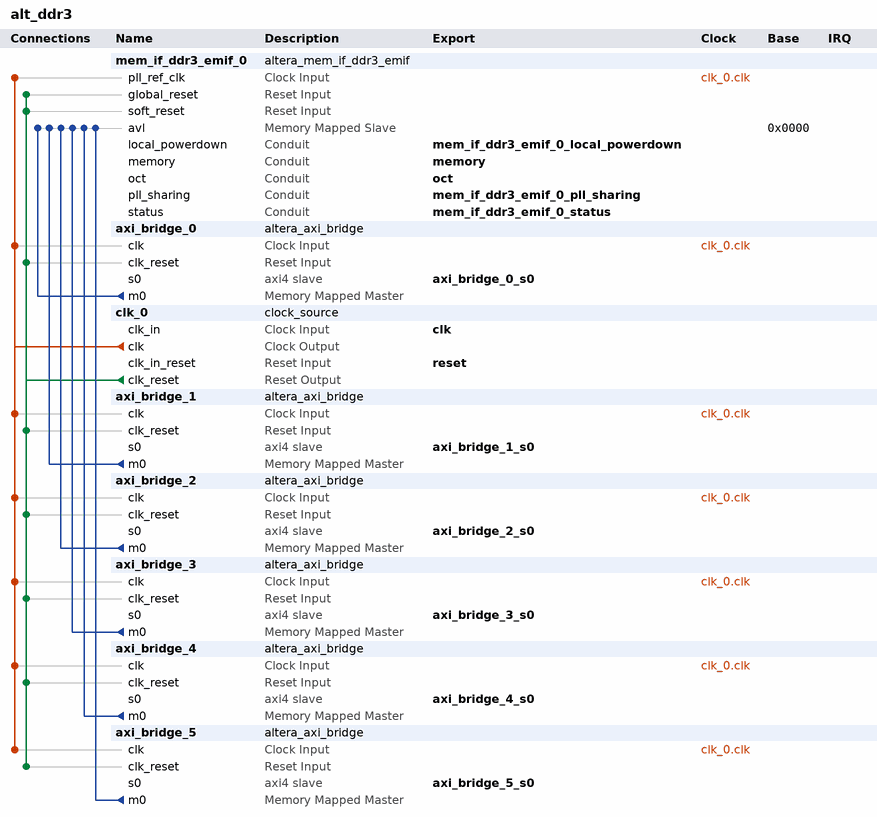
[diagram p0: system contents]
# Platform Designer (Qsys) system alt_ddr3, Cyclone V 5CGTFD9E5F35C7
# Parameters at their usual value, and those the tool derives, are not listed.
package require -exact qsys 20.1
create_system alt_ddr3
set_project_property DEVICE_FAMILY {Cyclone V}
set_project_property DEVICE 5CGTFD9E5F35C7

add_instance mem_if_ddr3_emif_0 altera_mem_if_ddr3_emif 20.1
set_instance_parameter_value mem_if_ddr3_emif_0 AVL_MAX_SIZE 8
set_instance_parameter_value mem_if_ddr3_emif_0 CALIBRATION_MODE Skip
set_instance_parameter_value mem_if_ddr3_emif_0 CFG_REORDER_DATA false
set_instance_parameter_value mem_if_ddr3_emif_0 CPORT_TYPE_PORT Bidirectional,Bidirectional,Bidirectional,Bidirectional,Bidirectional,Bidirectional
set_instance_parameter_value mem_if_ddr3_emif_0 EXPORT_AFI_HALF_CLK false
set_instance_parameter_value mem_if_ddr3_emif_0 HARD_EMIF false
set_instance_parameter_value mem_if_ddr3_emif_0 MEM_BANKADDR_WIDTH 3
set_instance_parameter_value mem_if_ddr3_emif_0 MEM_CLK_FREQ 300.0
set_instance_parameter_value mem_if_ddr3_emif_0 MEM_CLK_FREQ_MAX 800.0
set_instance_parameter_value mem_if_ddr3_emif_0 MEM_COL_ADDR_WIDTH 10
set_instance_parameter_value mem_if_ddr3_emif_0 MEM_DQ_WIDTH 16
set_instance_parameter_value mem_if_ddr3_emif_0 MEM_DRV_STR RZQ/6
set_instance_parameter_value mem_if_ddr3_emif_0 MEM_FORMAT DISCRETE
set_instance_parameter_value mem_if_ddr3_emif_0 MEM_ROW_ADDR_WIDTH 14
set_instance_parameter_value mem_if_ddr3_emif_0 MEM_RTT_NOM {ODT Disabled}
set_instance_parameter_value mem_if_ddr3_emif_0 MEM_RTT_WR {Dynamic ODT off}
set_instance_parameter_value mem_if_ddr3_emif_0 MEM_TCL 7
set_instance_parameter_value mem_if_ddr3_emif_0 MEM_TFAW_NS 50.0
set_instance_parameter_value mem_if_ddr3_emif_0 MEM_TRAS_NS 37.5
set_instance_parameter_value mem_if_ddr3_emif_0 MEM_TRCD_NS 13.125
set_instance_parameter_value mem_if_ddr3_emif_0 MEM_TRFC_NS 260.0
set_instance_parameter_value mem_if_ddr3_emif_0 MEM_TRP_NS 13.125
set_instance_parameter_value mem_if_ddr3_emif_0 MEM_TRRD_NS 7.5
set_instance_parameter_value mem_if_ddr3_emif_0 MEM_TRTP_NS 7.5
set_instance_parameter_value mem_if_ddr3_emif_0 MEM_TWTR 6
set_instance_parameter_value mem_if_ddr3_emif_0 MEM_VENDOR Micron
set_instance_parameter_value mem_if_ddr3_emif_0 MEM_WTCL 6
set_instance_parameter_value mem_if_ddr3_emif_0 PLL_LOCATION Top_Bottom
set_instance_parameter_value mem_if_ddr3_emif_0 POWER_OF_TWO_BUS false
set_instance_parameter_value mem_if_ddr3_emif_0 PRIORITY_PORT 1,1,1,1,1,1
set_instance_parameter_value mem_if_ddr3_emif_0 RATE Half
set_instance_parameter_value mem_if_ddr3_emif_0 REF_CLK_FREQ 50.0
set_instance_parameter_value mem_if_ddr3_emif_0 SPEED_GRADE 7
set_instance_parameter_value mem_if_ddr3_emif_0 TIMING_BOARD_AC_SKEW 0.04
set_instance_parameter_value mem_if_ddr3_emif_0 TIMING_BOARD_AC_TO_CK_SKEW 0.04
set_instance_parameter_value mem_if_ddr3_emif_0 TIMING_BOARD_DQ_TO_DQS_SKEW 0.004
set_instance_parameter_value mem_if_ddr3_emif_0 TIMING_BOARD_MAX_CK_DELAY 0.71
set_instance_parameter_value mem_if_ddr3_emif_0 TIMING_BOARD_MAX_DQS_DELAY 0.67
set_instance_parameter_value mem_if_ddr3_emif_0 TIMING_BOARD_SKEW_BETWEEN_DQS 0.0
set_instance_parameter_value mem_if_ddr3_emif_0 TIMING_BOARD_SKEW_CKDQS_DIMM_MAX 0.04
set_instance_parameter_value mem_if_ddr3_emif_0 TIMING_BOARD_SKEW_CKDQS_DIMM_MIN 0.0
set_instance_parameter_value mem_if_ddr3_emif_0 TIMING_BOARD_SKEW_WITHIN_DQS 0.2
set_instance_parameter_value mem_if_ddr3_emif_0 TIMING_TDH 100
set_instance_parameter_value mem_if_ddr3_emif_0 TIMING_TDQSCK 300
set_instance_parameter_value mem_if_ddr3_emif_0 TIMING_TDQSQ 150
set_instance_parameter_value mem_if_ddr3_emif_0 TIMING_TDQSS 0.25
set_instance_parameter_value mem_if_ddr3_emif_0 TIMING_TDS 25
set_instance_parameter_value mem_if_ddr3_emif_0 TIMING_TDSH 0.2
set_instance_parameter_value mem_if_ddr3_emif_0 TIMING_TDSS 0.2
set_instance_parameter_value mem_if_ddr3_emif_0 TIMING_TIH 200
set_instance_parameter_value mem_if_ddr3_emif_0 TIMING_TIS 125
set_instance_parameter_value mem_if_ddr3_emif_0 TIMING_TQSH 0.55
set_instance_parameter_value mem_if_ddr3_emif_0 USER_DEBUG_LEVEL 1

add_instance axi_bridge_0 altera_axi_bridge 20.1
set_instance_parameter_value axi_bridge_0 ADDR_WIDTH 28
set_instance_parameter_value axi_bridge_0 AXI_VERSION AXI4
set_instance_parameter_value axi_bridge_0 COMBINED_ACCEPTANCE_CAPABILITY 16
set_instance_parameter_value axi_bridge_0 COMBINED_ISSUING_CAPABILITY 16
set_instance_parameter_value axi_bridge_0 DATA_WIDTH 32
set_instance_parameter_value axi_bridge_0 M0_ID_WIDTH 1
set_instance_parameter_value axi_bridge_0 READ_ACCEPTANCE_CAPABILITY 16
set_instance_parameter_value axi_bridge_0 READ_ADDR_USER_WIDTH 64
set_instance_parameter_value axi_bridge_0 READ_DATA_REORDERING_DEPTH 1
set_instance_parameter_value axi_bridge_0 READ_DATA_USER_WIDTH 64
set_instance_parameter_value axi_bridge_0 READ_ISSUING_CAPABILITY 16
set_instance_parameter_value axi_bridge_0 S0_ID_WIDTH 1
set_instance_parameter_value axi_bridge_0 USE_M0_ARBURST 1
set_instance_parameter_value axi_bridge_0 USE_M0_ARCACHE 1
set_instance_parameter_value axi_bridge_0 USE_M0_ARID 1
set_instance_parameter_value axi_bridge_0 USE_M0_ARLEN 1
set_instance_parameter_value axi_bridge_0 USE_M0_ARLOCK 1
set_instance_parameter_value axi_bridge_0 USE_M0_ARQOS 0
set_instance_parameter_value axi_bridge_0 USE_M0_ARREGION 0
set_instance_parameter_value axi_bridge_0 USE_M0_ARSIZE 1
set_instance_parameter_value axi_bridge_0 USE_M0_ARUSER 0
set_instance_parameter_value axi_bridge_0 USE_M0_AWBURST 1
set_instance_parameter_value axi_bridge_0 USE_M0_AWCACHE 1
set_instance_parameter_value axi_bridge_0 USE_M0_AWID 1
set_instance_parameter_value axi_bridge_0 USE_M0_AWLEN 1
set_instance_parameter_value axi_bridge_0 USE_M0_AWLOCK 1
set_instance_parameter_value axi_bridge_0 USE_M0_AWQOS 0
set_instance_parameter_value axi_bridge_0 USE_M0_AWREGION 0
set_instance_parameter_value axi_bridge_0 USE_M0_AWSIZE 1
set_instance_parameter_value axi_bridge_0 USE_M0_AWUSER 0
set_instance_parameter_value axi_bridge_0 USE_M0_BID 1
set_instance_parameter_value axi_bridge_0 USE_M0_BRESP 1
set_instance_parameter_value axi_bridge_0 USE_M0_BUSER 0
set_instance_parameter_value axi_bridge_0 USE_M0_RID 1
set_instance_parameter_value axi_bridge_0 USE_M0_RLAST 1
set_instance_parameter_value axi_bridge_0 USE_M0_RRESP 1
set_instance_parameter_value axi_bridge_0 USE_M0_RUSER 0
set_instance_parameter_value axi_bridge_0 USE_M0_WSTRB 1
set_instance_parameter_value axi_bridge_0 USE_M0_WUSER 0
set_instance_parameter_value axi_bridge_0 USE_PIPELINE 1
set_instance_parameter_value axi_bridge_0 USE_S0_ARCACHE 1
set_instance_parameter_value axi_bridge_0 USE_S0_ARLOCK 1
set_instance_parameter_value axi_bridge_0 USE_S0_ARPROT 1
set_instance_parameter_value axi_bridge_0 USE_S0_ARQOS 0
set_instance_parameter_value axi_bridge_0 USE_S0_ARREGION 0
set_instance_parameter_value axi_bridge_0 USE_S0_ARUSER 0
set_instance_parameter_value axi_bridge_0 USE_S0_AWCACHE 1
set_instance_parameter_value axi_bridge_0 USE_S0_AWLOCK 1
set_instance_parameter_value axi_bridge_0 USE_S0_AWPROT 1
set_instance_parameter_value axi_bridge_0 USE_S0_AWQOS 0
set_instance_parameter_value axi_bridge_0 USE_S0_AWREGION 0
set_instance_parameter_value axi_bridge_0 USE_S0_AWUSER 0
set_instance_parameter_value axi_bridge_0 USE_S0_BRESP 1
set_instance_parameter_value axi_bridge_0 USE_S0_BUSER 0
set_instance_parameter_value axi_bridge_0 USE_S0_RRESP 1
set_instance_parameter_value axi_bridge_0 USE_S0_RUSER 0
set_instance_parameter_value axi_bridge_0 USE_S0_WLAST 1
set_instance_parameter_value axi_bridge_0 USE_S0_WUSER 0
set_instance_parameter_value axi_bridge_0 WRITE_ACCEPTANCE_CAPABILITY 16
set_instance_parameter_value axi_bridge_0 WRITE_ADDR_USER_WIDTH 64
set_instance_parameter_value axi_bridge_0 WRITE_DATA_USER_WIDTH 64
set_instance_parameter_value axi_bridge_0 WRITE_ISSUING_CAPABILITY 16
set_instance_parameter_value axi_bridge_0 WRITE_RESP_USER_WIDTH 64

add_instance clk_0 clock_source 20.1
set_instance_parameter_value clk_0 clockFrequency 50000000

add_instance axi_bridge_1 altera_axi_bridge 20.1
set_instance_parameter_value axi_bridge_1 ADDR_WIDTH 28
set_instance_parameter_value axi_bridge_1 AXI_VERSION AXI4
set_instance_parameter_value axi_bridge_1 COMBINED_ACCEPTANCE_CAPABILITY 16
set_instance_parameter_value axi_bridge_1 COMBINED_ISSUING_CAPABILITY 16
set_instance_parameter_value axi_bridge_1 DATA_WIDTH 32
set_instance_parameter_value axi_bridge_1 M0_ID_WIDTH 1
set_instance_parameter_value axi_bridge_1 READ_ACCEPTANCE_CAPABILITY 16
set_instance_parameter_value axi_bridge_1 READ_ADDR_USER_WIDTH 64
set_instance_parameter_value axi_bridge_1 READ_DATA_REORDERING_DEPTH 1
set_instance_parameter_value axi_bridge_1 READ_DATA_USER_WIDTH 64
set_instance_parameter_value axi_bridge_1 READ_ISSUING_CAPABILITY 16
set_instance_parameter_value axi_bridge_1 S0_ID_WIDTH 1
set_instance_parameter_value axi_bridge_1 USE_M0_ARBURST 1
set_instance_parameter_value axi_bridge_1 USE_M0_ARCACHE 1
set_instance_parameter_value axi_bridge_1 USE_M0_ARID 1
set_instance_parameter_value axi_bridge_1 USE_M0_ARLEN 1
set_instance_parameter_value axi_bridge_1 USE_M0_ARLOCK 1
set_instance_parameter_value axi_bridge_1 USE_M0_ARQOS 0
set_instance_parameter_value axi_bridge_1 USE_M0_ARREGION 0
set_instance_parameter_value axi_bridge_1 USE_M0_ARSIZE 1
set_instance_parameter_value axi_bridge_1 USE_M0_ARUSER 0
set_instance_parameter_value axi_bridge_1 USE_M0_AWBURST 1
set_instance_parameter_value axi_bridge_1 USE_M0_AWCACHE 1
set_instance_parameter_value axi_bridge_1 USE_M0_AWID 1
set_instance_parameter_value axi_bridge_1 USE_M0_AWLEN 1
set_instance_parameter_value axi_bridge_1 USE_M0_AWLOCK 1
set_instance_parameter_value axi_bridge_1 USE_M0_AWQOS 0
set_instance_parameter_value axi_bridge_1 USE_M0_AWREGION 0
set_instance_parameter_value axi_bridge_1 USE_M0_AWSIZE 1
set_instance_parameter_value axi_bridge_1 USE_M0_AWUSER 0
set_instance_parameter_value axi_bridge_1 USE_M0_BID 1
set_instance_parameter_value axi_bridge_1 USE_M0_BRESP 1
set_instance_parameter_value axi_bridge_1 USE_M0_BUSER 0
set_instance_parameter_value axi_bridge_1 USE_M0_RID 1
set_instance_parameter_value axi_bridge_1 USE_M0_RLAST 1
set_instance_parameter_value axi_bridge_1 USE_M0_RRESP 1
set_instance_parameter_value axi_bridge_1 USE_M0_RUSER 0
set_instance_parameter_value axi_bridge_1 USE_M0_WSTRB 1
set_instance_parameter_value axi_bridge_1 USE_M0_WUSER 0
set_instance_parameter_value axi_bridge_1 USE_PIPELINE 1
set_instance_parameter_value axi_bridge_1 USE_S0_ARCACHE 1
set_instance_parameter_value axi_bridge_1 USE_S0_ARLOCK 1
set_instance_parameter_value axi_bridge_1 USE_S0_ARPROT 1
set_instance_parameter_value axi_bridge_1 USE_S0_ARQOS 0
set_instance_parameter_value axi_bridge_1 USE_S0_ARREGION 0
set_instance_parameter_value axi_bridge_1 USE_S0_ARUSER 0
set_instance_parameter_value axi_bridge_1 USE_S0_AWCACHE 1
set_instance_parameter_value axi_bridge_1 USE_S0_AWLOCK 1
set_instance_parameter_value axi_bridge_1 USE_S0_AWPROT 1
set_instance_parameter_value axi_bridge_1 USE_S0_AWQOS 0
set_instance_parameter_value axi_bridge_1 USE_S0_AWREGION 0
set_instance_parameter_value axi_bridge_1 USE_S0_AWUSER 0
set_instance_parameter_value axi_bridge_1 USE_S0_BRESP 1
set_instance_parameter_value axi_bridge_1 USE_S0_BUSER 0
set_instance_parameter_value axi_bridge_1 USE_S0_RRESP 1
set_instance_parameter_value axi_bridge_1 USE_S0_RUSER 0
set_instance_parameter_value axi_bridge_1 USE_S0_WLAST 1
set_instance_parameter_value axi_bridge_1 USE_S0_WUSER 0
set_instance_parameter_value axi_bridge_1 WRITE_ACCEPTANCE_CAPABILITY 16
set_instance_parameter_value axi_bridge_1 WRITE_ADDR_USER_WIDTH 64
set_instance_parameter_value axi_bridge_1 WRITE_DATA_USER_WIDTH 64
set_instance_parameter_value axi_bridge_1 WRITE_ISSUING_CAPABILITY 16
set_instance_parameter_value axi_bridge_1 WRITE_RESP_USER_WIDTH 64

add_instance axi_bridge_2 altera_axi_bridge 20.1
set_instance_parameter_value axi_bridge_2 ADDR_WIDTH 28
set_instance_parameter_value axi_bridge_2 AXI_VERSION AXI4
set_instance_parameter_value axi_bridge_2 COMBINED_ACCEPTANCE_CAPABILITY 16
set_instance_parameter_value axi_bridge_2 COMBINED_ISSUING_CAPABILITY 16
set_instance_parameter_value axi_bridge_2 DATA_WIDTH 32
set_instance_parameter_value axi_bridge_2 M0_ID_WIDTH 1
set_instance_parameter_value axi_bridge_2 READ_ACCEPTANCE_CAPABILITY 16
set_instance_parameter_value axi_bridge_2 READ_ADDR_USER_WIDTH 64
set_instance_parameter_value axi_bridge_2 READ_DATA_REORDERING_DEPTH 1
set_instance_parameter_value axi_bridge_2 READ_DATA_USER_WIDTH 64
set_instance_parameter_value axi_bridge_2 READ_ISSUING_CAPABILITY 16
set_instance_parameter_value axi_bridge_2 S0_ID_WIDTH 1
set_instance_parameter_value axi_bridge_2 USE_M0_ARBURST 1
set_instance_parameter_value axi_bridge_2 USE_M0_ARCACHE 1
set_instance_parameter_value axi_bridge_2 USE_M0_ARID 1
set_instance_parameter_value axi_bridge_2 USE_M0_ARLEN 1
set_instance_parameter_value axi_bridge_2 USE_M0_ARLOCK 1
set_instance_parameter_value axi_bridge_2 USE_M0_ARQOS 0
set_instance_parameter_value axi_bridge_2 USE_M0_ARREGION 0
set_instance_parameter_value axi_bridge_2 USE_M0_ARSIZE 1
set_instance_parameter_value axi_bridge_2 USE_M0_ARUSER 0
set_instance_parameter_value axi_bridge_2 USE_M0_AWBURST 1
set_instance_parameter_value axi_bridge_2 USE_M0_AWCACHE 1
set_instance_parameter_value axi_bridge_2 USE_M0_AWID 1
set_instance_parameter_value axi_bridge_2 USE_M0_AWLEN 1
set_instance_parameter_value axi_bridge_2 USE_M0_AWLOCK 1
set_instance_parameter_value axi_bridge_2 USE_M0_AWQOS 0
set_instance_parameter_value axi_bridge_2 USE_M0_AWREGION 0
set_instance_parameter_value axi_bridge_2 USE_M0_AWSIZE 1
set_instance_parameter_value axi_bridge_2 USE_M0_AWUSER 0
set_instance_parameter_value axi_bridge_2 USE_M0_BID 1
set_instance_parameter_value axi_bridge_2 USE_M0_BRESP 1
set_instance_parameter_value axi_bridge_2 USE_M0_BUSER 0
set_instance_parameter_value axi_bridge_2 USE_M0_RID 1
set_instance_parameter_value axi_bridge_2 USE_M0_RLAST 1
set_instance_parameter_value axi_bridge_2 USE_M0_RRESP 1
set_instance_parameter_value axi_bridge_2 USE_M0_RUSER 0
set_instance_parameter_value axi_bridge_2 USE_M0_WSTRB 1
set_instance_parameter_value axi_bridge_2 USE_M0_WUSER 0
set_instance_parameter_value axi_bridge_2 USE_PIPELINE 1
set_instance_parameter_value axi_bridge_2 USE_S0_ARCACHE 1
set_instance_parameter_value axi_bridge_2 USE_S0_ARLOCK 1
set_instance_parameter_value axi_bridge_2 USE_S0_ARPROT 1
set_instance_parameter_value axi_bridge_2 USE_S0_ARQOS 0
set_instance_parameter_value axi_bridge_2 USE_S0_ARREGION 0
set_instance_parameter_value axi_bridge_2 USE_S0_ARUSER 0
set_instance_parameter_value axi_bridge_2 USE_S0_AWCACHE 1
set_instance_parameter_value axi_bridge_2 USE_S0_AWLOCK 1
set_instance_parameter_value axi_bridge_2 USE_S0_AWPROT 1
set_instance_parameter_value axi_bridge_2 USE_S0_AWQOS 0
set_instance_parameter_value axi_bridge_2 USE_S0_AWREGION 0
set_instance_parameter_value axi_bridge_2 USE_S0_AWUSER 0
set_instance_parameter_value axi_bridge_2 USE_S0_BRESP 1
set_instance_parameter_value axi_bridge_2 USE_S0_BUSER 0
set_instance_parameter_value axi_bridge_2 USE_S0_RRESP 1
set_instance_parameter_value axi_bridge_2 USE_S0_RUSER 0
set_instance_parameter_value axi_bridge_2 USE_S0_WLAST 1
set_instance_parameter_value axi_bridge_2 USE_S0_WUSER 0
set_instance_parameter_value axi_bridge_2 WRITE_ACCEPTANCE_CAPABILITY 16
set_instance_parameter_value axi_bridge_2 WRITE_ADDR_USER_WIDTH 64
set_instance_parameter_value axi_bridge_2 WRITE_DATA_USER_WIDTH 64
set_instance_parameter_value axi_bridge_2 WRITE_ISSUING_CAPABILITY 16
set_instance_parameter_value axi_bridge_2 WRITE_RESP_USER_WIDTH 64

add_instance axi_bridge_3 altera_axi_bridge 20.1
set_instance_parameter_value axi_bridge_3 ADDR_WIDTH 28
set_instance_parameter_value axi_bridge_3 AXI_VERSION AXI4
set_instance_parameter_value axi_bridge_3 COMBINED_ACCEPTANCE_CAPABILITY 16
set_instance_parameter_value axi_bridge_3 COMBINED_ISSUING_CAPABILITY 16
set_instance_parameter_value axi_bridge_3 DATA_WIDTH 32
set_instance_parameter_value axi_bridge_3 M0_ID_WIDTH 1
set_instance_parameter_value axi_bridge_3 READ_ACCEPTANCE_CAPABILITY 16
set_instance_parameter_value axi_bridge_3 READ_ADDR_USER_WIDTH 64
set_instance_parameter_value axi_bridge_3 READ_DATA_REORDERING_DEPTH 1
set_instance_parameter_value axi_bridge_3 READ_DATA_USER_WIDTH 64
set_instance_parameter_value axi_bridge_3 READ_ISSUING_CAPABILITY 16
set_instance_parameter_value axi_bridge_3 S0_ID_WIDTH 1
set_instance_parameter_value axi_bridge_3 USE_M0_ARBURST 1
set_instance_parameter_value axi_bridge_3 USE_M0_ARCACHE 1
set_instance_parameter_value axi_bridge_3 USE_M0_ARID 1
set_instance_parameter_value axi_bridge_3 USE_M0_ARLEN 1
set_instance_parameter_value axi_bridge_3 USE_M0_ARLOCK 1
set_instance_parameter_value axi_bridge_3 USE_M0_ARQOS 0
set_instance_parameter_value axi_bridge_3 USE_M0_ARREGION 0
set_instance_parameter_value axi_bridge_3 USE_M0_ARSIZE 1
set_instance_parameter_value axi_bridge_3 USE_M0_ARUSER 0
set_instance_parameter_value axi_bridge_3 USE_M0_AWBURST 1
set_instance_parameter_value axi_bridge_3 USE_M0_AWCACHE 1
set_instance_parameter_value axi_bridge_3 USE_M0_AWID 1
set_instance_parameter_value axi_bridge_3 USE_M0_AWLEN 1
set_instance_parameter_value axi_bridge_3 USE_M0_AWLOCK 1
set_instance_parameter_value axi_bridge_3 USE_M0_AWQOS 0
set_instance_parameter_value axi_bridge_3 USE_M0_AWREGION 0
set_instance_parameter_value axi_bridge_3 USE_M0_AWSIZE 1
set_instance_parameter_value axi_bridge_3 USE_M0_AWUSER 0
set_instance_parameter_value axi_bridge_3 USE_M0_BID 1
set_instance_parameter_value axi_bridge_3 USE_M0_BRESP 1
set_instance_parameter_value axi_bridge_3 USE_M0_BUSER 0
set_instance_parameter_value axi_bridge_3 USE_M0_RID 1
set_instance_parameter_value axi_bridge_3 USE_M0_RLAST 1
set_instance_parameter_value axi_bridge_3 USE_M0_RRESP 1
set_instance_parameter_value axi_bridge_3 USE_M0_RUSER 0
set_instance_parameter_value axi_bridge_3 USE_M0_WSTRB 1
set_instance_parameter_value axi_bridge_3 USE_M0_WUSER 0
set_instance_parameter_value axi_bridge_3 USE_PIPELINE 1
set_instance_parameter_value axi_bridge_3 USE_S0_ARCACHE 1
set_instance_parameter_value axi_bridge_3 USE_S0_ARLOCK 1
set_instance_parameter_value axi_bridge_3 USE_S0_ARPROT 1
set_instance_parameter_value axi_bridge_3 USE_S0_ARQOS 0
set_instance_parameter_value axi_bridge_3 USE_S0_ARREGION 0
set_instance_parameter_value axi_bridge_3 USE_S0_ARUSER 0
set_instance_parameter_value axi_bridge_3 USE_S0_AWCACHE 1
set_instance_parameter_value axi_bridge_3 USE_S0_AWLOCK 1
set_instance_parameter_value axi_bridge_3 USE_S0_AWPROT 1
set_instance_parameter_value axi_bridge_3 USE_S0_AWQOS 0
set_instance_parameter_value axi_bridge_3 USE_S0_AWREGION 0
set_instance_parameter_value axi_bridge_3 USE_S0_AWUSER 0
set_instance_parameter_value axi_bridge_3 USE_S0_BRESP 1
set_instance_parameter_value axi_bridge_3 USE_S0_BUSER 0
set_instance_parameter_value axi_bridge_3 USE_S0_RRESP 1
set_instance_parameter_value axi_bridge_3 USE_S0_RUSER 0
set_instance_parameter_value axi_bridge_3 USE_S0_WLAST 1
set_instance_parameter_value axi_bridge_3 USE_S0_WUSER 0
set_instance_parameter_value axi_bridge_3 WRITE_ACCEPTANCE_CAPABILITY 16
set_instance_parameter_value axi_bridge_3 WRITE_ADDR_USER_WIDTH 64
set_instance_parameter_value axi_bridge_3 WRITE_DATA_USER_WIDTH 64
set_instance_parameter_value axi_bridge_3 WRITE_ISSUING_CAPABILITY 16
set_instance_parameter_value axi_bridge_3 WRITE_RESP_USER_WIDTH 64

add_instance axi_bridge_4 altera_axi_bridge 20.1
set_instance_parameter_value axi_bridge_4 ADDR_WIDTH 28
set_instance_parameter_value axi_bridge_4 AXI_VERSION AXI4
set_instance_parameter_value axi_bridge_4 COMBINED_ACCEPTANCE_CAPABILITY 16
set_instance_parameter_value axi_bridge_4 COMBINED_ISSUING_CAPABILITY 16
set_instance_parameter_value axi_bridge_4 DATA_WIDTH 32
set_instance_parameter_value axi_bridge_4 M0_ID_WIDTH 1
set_instance_parameter_value axi_bridge_4 READ_ACCEPTANCE_CAPABILITY 16
set_instance_parameter_value axi_bridge_4 READ_ADDR_USER_WIDTH 64
set_instance_parameter_value axi_bridge_4 READ_DATA_REORDERING_DEPTH 1
set_instance_parameter_value axi_bridge_4 READ_DATA_USER_WIDTH 64
set_instance_parameter_value axi_bridge_4 READ_ISSUING_CAPABILITY 16
set_instance_parameter_value axi_bridge_4 S0_ID_WIDTH 1
set_instance_parameter_value axi_bridge_4 USE_M0_ARBURST 1
set_instance_parameter_value axi_bridge_4 USE_M0_ARCACHE 1
set_instance_parameter_value axi_bridge_4 USE_M0_ARID 1
set_instance_parameter_value axi_bridge_4 USE_M0_ARLEN 1
set_instance_parameter_value axi_bridge_4 USE_M0_ARLOCK 1
set_instance_parameter_value axi_bridge_4 USE_M0_ARQOS 0
set_instance_parameter_value axi_bridge_4 USE_M0_ARREGION 0
set_instance_parameter_value axi_bridge_4 USE_M0_ARSIZE 1
set_instance_parameter_value axi_bridge_4 USE_M0_ARUSER 0
set_instance_parameter_value axi_bridge_4 USE_M0_AWBURST 1
set_instance_parameter_value axi_bridge_4 USE_M0_AWCACHE 1
set_instance_parameter_value axi_bridge_4 USE_M0_AWID 1
set_instance_parameter_value axi_bridge_4 USE_M0_AWLEN 1
set_instance_parameter_value axi_bridge_4 USE_M0_AWLOCK 1
set_instance_parameter_value axi_bridge_4 USE_M0_AWQOS 0
set_instance_parameter_value axi_bridge_4 USE_M0_AWREGION 0
set_instance_parameter_value axi_bridge_4 USE_M0_AWSIZE 1
set_instance_parameter_value axi_bridge_4 USE_M0_AWUSER 0
set_instance_parameter_value axi_bridge_4 USE_M0_BID 1
set_instance_parameter_value axi_bridge_4 USE_M0_BRESP 1
set_instance_parameter_value axi_bridge_4 USE_M0_BUSER 0
set_instance_parameter_value axi_bridge_4 USE_M0_RID 1
set_instance_parameter_value axi_bridge_4 USE_M0_RLAST 1
set_instance_parameter_value axi_bridge_4 USE_M0_RRESP 1
set_instance_parameter_value axi_bridge_4 USE_M0_RUSER 0
set_instance_parameter_value axi_bridge_4 USE_M0_WSTRB 1
set_instance_parameter_value axi_bridge_4 USE_M0_WUSER 0
set_instance_parameter_value axi_bridge_4 USE_PIPELINE 1
set_instance_parameter_value axi_bridge_4 USE_S0_ARCACHE 1
set_instance_parameter_value axi_bridge_4 USE_S0_ARLOCK 1
set_instance_parameter_value axi_bridge_4 USE_S0_ARPROT 1
set_instance_parameter_value axi_bridge_4 USE_S0_ARQOS 0
set_instance_parameter_value axi_bridge_4 USE_S0_ARREGION 0
set_instance_parameter_value axi_bridge_4 USE_S0_ARUSER 0
set_instance_parameter_value axi_bridge_4 USE_S0_AWCACHE 1
set_instance_parameter_value axi_bridge_4 USE_S0_AWLOCK 1
set_instance_parameter_value axi_bridge_4 USE_S0_AWPROT 1
set_instance_parameter_value axi_bridge_4 USE_S0_AWQOS 0
set_instance_parameter_value axi_bridge_4 USE_S0_AWREGION 0
set_instance_parameter_value axi_bridge_4 USE_S0_AWUSER 0
set_instance_parameter_value axi_bridge_4 USE_S0_BRESP 1
set_instance_parameter_value axi_bridge_4 USE_S0_BUSER 0
set_instance_parameter_value axi_bridge_4 USE_S0_RRESP 1
set_instance_parameter_value axi_bridge_4 USE_S0_RUSER 0
set_instance_parameter_value axi_bridge_4 USE_S0_WLAST 1
set_instance_parameter_value axi_bridge_4 USE_S0_WUSER 0
set_instance_parameter_value axi_bridge_4 WRITE_ACCEPTANCE_CAPABILITY 16
set_instance_parameter_value axi_bridge_4 WRITE_ADDR_USER_WIDTH 64
set_instance_parameter_value axi_bridge_4 WRITE_DATA_USER_WIDTH 64
set_instance_parameter_value axi_bridge_4 WRITE_ISSUING_CAPABILITY 16
set_instance_parameter_value axi_bridge_4 WRITE_RESP_USER_WIDTH 64

add_instance axi_bridge_5 altera_axi_bridge 20.1
set_instance_parameter_value axi_bridge_5 ADDR_WIDTH 28
set_instance_parameter_value axi_bridge_5 AXI_VERSION AXI4
set_instance_parameter_value axi_bridge_5 COMBINED_ACCEPTANCE_CAPABILITY 16
set_instance_parameter_value axi_bridge_5 COMBINED_ISSUING_CAPABILITY 16
set_instance_parameter_value axi_bridge_5 DATA_WIDTH 32
set_instance_parameter_value axi_bridge_5 M0_ID_WIDTH 1
set_instance_parameter_value axi_bridge_5 READ_ACCEPTANCE_CAPABILITY 16
set_instance_parameter_value axi_bridge_5 READ_ADDR_USER_WIDTH 64
set_instance_parameter_value axi_bridge_5 READ_DATA_REORDERING_DEPTH 1
set_instance_parameter_value axi_bridge_5 READ_DATA_USER_WIDTH 64
set_instance_parameter_value axi_bridge_5 READ_ISSUING_CAPABILITY 16
set_instance_parameter_value axi_bridge_5 S0_ID_WIDTH 1
set_instance_parameter_value axi_bridge_5 USE_M0_ARBURST 1
set_instance_parameter_value axi_bridge_5 USE_M0_ARCACHE 1
set_instance_parameter_value axi_bridge_5 USE_M0_ARID 1
set_instance_parameter_value axi_bridge_5 USE_M0_ARLEN 1
set_instance_parameter_value axi_bridge_5 USE_M0_ARLOCK 1
set_instance_parameter_value axi_bridge_5 USE_M0_ARQOS 0
set_instance_parameter_value axi_bridge_5 USE_M0_ARREGION 0
set_instance_parameter_value axi_bridge_5 USE_M0_ARSIZE 1
set_instance_parameter_value axi_bridge_5 USE_M0_ARUSER 0
set_instance_parameter_value axi_bridge_5 USE_M0_AWBURST 1
set_instance_parameter_value axi_bridge_5 USE_M0_AWCACHE 1
set_instance_parameter_value axi_bridge_5 USE_M0_AWID 1
set_instance_parameter_value axi_bridge_5 USE_M0_AWLEN 1
set_instance_parameter_value axi_bridge_5 USE_M0_AWLOCK 1
set_instance_parameter_value axi_bridge_5 USE_M0_AWQOS 0
set_instance_parameter_value axi_bridge_5 USE_M0_AWREGION 0
set_instance_parameter_value axi_bridge_5 USE_M0_AWSIZE 1
set_instance_parameter_value axi_bridge_5 USE_M0_AWUSER 0
set_instance_parameter_value axi_bridge_5 USE_M0_BID 1
set_instance_parameter_value axi_bridge_5 USE_M0_BRESP 1
set_instance_parameter_value axi_bridge_5 USE_M0_BUSER 0
set_instance_parameter_value axi_bridge_5 USE_M0_RID 1
set_instance_parameter_value axi_bridge_5 USE_M0_RLAST 1
set_instance_parameter_value axi_bridge_5 USE_M0_RRESP 1
set_instance_parameter_value axi_bridge_5 USE_M0_RUSER 0
set_instance_parameter_value axi_bridge_5 USE_M0_WSTRB 1
set_instance_parameter_value axi_bridge_5 USE_M0_WUSER 0
set_instance_parameter_value axi_bridge_5 USE_PIPELINE 1
set_instance_parameter_value axi_bridge_5 USE_S0_ARCACHE 1
set_instance_parameter_value axi_bridge_5 USE_S0_ARLOCK 1
set_instance_parameter_value axi_bridge_5 USE_S0_ARPROT 1
set_instance_parameter_value axi_bridge_5 USE_S0_ARQOS 0
set_instance_parameter_value axi_bridge_5 USE_S0_ARREGION 0
set_instance_parameter_value axi_bridge_5 USE_S0_ARUSER 0
set_instance_parameter_value axi_bridge_5 USE_S0_AWCACHE 1
set_instance_parameter_value axi_bridge_5 USE_S0_AWLOCK 1
set_instance_parameter_value axi_bridge_5 USE_S0_AWPROT 1
set_instance_parameter_value axi_bridge_5 USE_S0_AWQOS 0
set_instance_parameter_value axi_bridge_5 USE_S0_AWREGION 0
set_instance_parameter_value axi_bridge_5 USE_S0_AWUSER 0
set_instance_parameter_value axi_bridge_5 USE_S0_BRESP 1
set_instance_parameter_value axi_bridge_5 USE_S0_BUSER 0
set_instance_parameter_value axi_bridge_5 USE_S0_RRESP 1
set_instance_parameter_value axi_bridge_5 USE_S0_RUSER 0
set_instance_parameter_value axi_bridge_5 USE_S0_WLAST 1
set_instance_parameter_value axi_bridge_5 USE_S0_WUSER 0
set_instance_parameter_value axi_bridge_5 WRITE_ACCEPTANCE_CAPABILITY 16
set_instance_parameter_value axi_bridge_5 WRITE_ADDR_USER_WIDTH 64
set_instance_parameter_value axi_bridge_5 WRITE_DATA_USER_WIDTH 64
set_instance_parameter_value axi_bridge_5 WRITE_ISSUING_CAPABILITY 16
set_instance_parameter_value axi_bridge_5 WRITE_RESP_USER_WIDTH 64

# connections
add_connection clk_0.clk axi_bridge_0.clk clock
add_connection clk_0.clk axi_bridge_1.clk clock
add_connection clk_0.clk axi_bridge_2.clk clock
add_connection clk_0.clk axi_bridge_3.clk clock
add_connection clk_0.clk axi_bridge_4.clk clock
add_connection clk_0.clk axi_bridge_5.clk clock
add_connection clk_0.clk mem_if_ddr3_emif_0.pll_ref_clk clock
add_connection clk_0.clk_reset axi_bridge_0.clk_reset reset
add_connection clk_0.clk_reset axi_bridge_1.clk_reset reset
add_connection clk_0.clk_reset axi_bridge_2.clk_reset reset
add_connection clk_0.clk_reset axi_bridge_3.clk_reset reset
add_connection clk_0.clk_reset axi_bridge_4.clk_reset reset
add_connection clk_0.clk_reset axi_bridge_5.clk_reset reset
add_connection clk_0.clk_reset mem_if_ddr3_emif_0.global_reset reset
add_connection clk_0.clk_reset mem_if_ddr3_emif_0.soft_reset reset
add_connection axi_bridge_0.m0 mem_if_ddr3_emif_0.avl avalon
set_connection_parameter_value axi_bridge_0.m0/mem_if_ddr3_emif_0.avl baseAddress 0x0000
add_connection axi_bridge_1.m0 mem_if_ddr3_emif_0.avl avalon
set_connection_parameter_value axi_bridge_1.m0/mem_if_ddr3_emif_0.avl baseAddress 0x0000
add_connection axi_bridge_2.m0 mem_if_ddr3_emif_0.avl avalon
set_connection_parameter_value axi_bridge_2.m0/mem_if_ddr3_emif_0.avl baseAddress 0x0000
add_connection axi_bridge_3.m0 mem_if_ddr3_emif_0.avl avalon
set_connection_parameter_value axi_bridge_3.m0/mem_if_ddr3_emif_0.avl baseAddress 0x0000
add_connection axi_bridge_4.m0 mem_if_ddr3_emif_0.avl avalon
set_connection_parameter_value axi_bridge_4.m0/mem_if_ddr3_emif_0.avl baseAddress 0x0000
add_connection axi_bridge_5.m0 mem_if_ddr3_emif_0.avl avalon
set_connection_parameter_value axi_bridge_5.m0/mem_if_ddr3_emif_0.avl baseAddress 0x0000

# exported interfaces
add_interface axi_bridge_0_s0 axi4 slave
set_interface_property axi_bridge_0_s0 EXPORT_OF axi_bridge_0.s0
add_interface axi_bridge_1_s0 axi4 slave
set_interface_property axi_bridge_1_s0 EXPORT_OF axi_bridge_1.s0
add_interface axi_bridge_2_s0 axi4 slave
set_interface_property axi_bridge_2_s0 EXPORT_OF axi_bridge_2.s0
add_interface axi_bridge_3_s0 axi4 slave
set_interface_property axi_bridge_3_s0 EXPORT_OF axi_bridge_3.s0
add_interface axi_bridge_4_s0 axi4 slave
set_interface_property axi_bridge_4_s0 EXPORT_OF axi_bridge_4.s0
add_interface axi_bridge_5_s0 axi4 slave
set_interface_property axi_bridge_5_s0 EXPORT_OF axi_bridge_5.s0
add_interface clk clock sink
set_interface_property clk EXPORT_OF clk_0.clk_in
add_interface mem_if_ddr3_emif_0_local_powerdown conduit end
set_interface_property mem_if_ddr3_emif_0_local_powerdown EXPORT_OF mem_if_ddr3_emif_0.local_powerdown
add_interface mem_if_ddr3_emif_0_pll_sharing conduit end
set_interface_property mem_if_ddr3_emif_0_pll_sharing EXPORT_OF mem_if_ddr3_emif_0.pll_sharing
add_interface mem_if_ddr3_emif_0_status conduit end
set_interface_property mem_if_ddr3_emif_0_status EXPORT_OF mem_if_ddr3_emif_0.status
add_interface memory conduit end
set_interface_property memory EXPORT_OF mem_if_ddr3_emif_0.memory
add_interface oct conduit end
set_interface_property oct EXPORT_OF mem_if_ddr3_emif_0.oct
add_interface reset reset sink
set_interface_property reset EXPORT_OF clk_0.clk_in_reset

set_interconnect_requirement {$system} qsys_mm.clockCrossingAdapter HANDSHAKE
set_interconnect_requirement {$system} qsys_mm.enableEccProtection FALSE
set_interconnect_requirement {$system} qsys_mm.insertDefaultSlave FALSE
set_interconnect_requirement {$system} qsys_mm.maxAdditionalLatency 1

save_system alt_ddr3.qsys
